# Altium schematic sheet [4]-RF.SchDoc
size A4
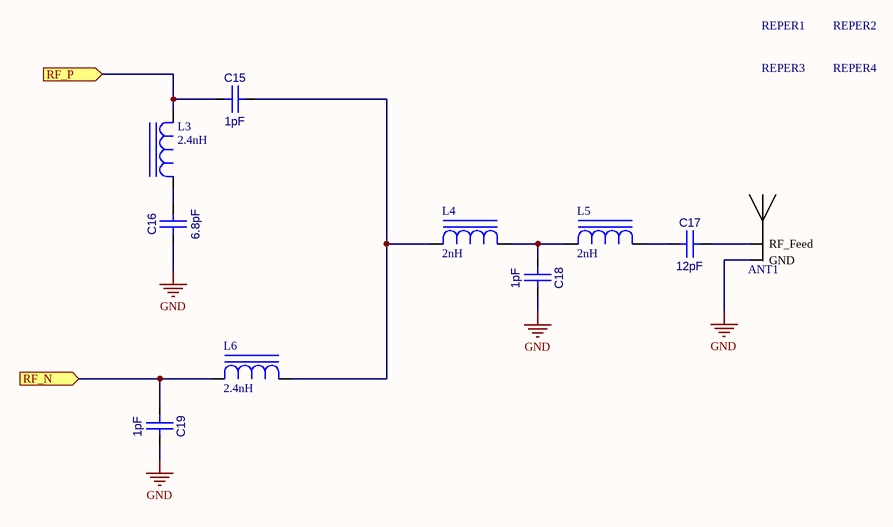
[diagram p0: [4]-RF.SchDoc]

## Parts
ANT1  IFA_TI_2.4G_Reference  [ANT_IFA_2.4G_BEST]  (value not drawn)
C15  1pF  [CC0603]
C16  6.8pF  [CC0603]
C17  12pF  [CC0603]
C18  1pF  [CC0603]
C19  1pF  [CC0603]
L3  2.4nH  [L0402]
L4  2nH  [L0402]
L5  2nH  [L0402]
L6  2.4nH  [L0402]
REPER1  REPER1.2  [REPER1.2]  (value not drawn)
REPER2  REPER1.2  [REPER1.2]  (value not drawn)
REPER3  REPER1.2  [REPER1.2]  (value not drawn)
REPER4  REPER1.2  [REPER1.2]  (value not drawn)

## Ports
RF_N (in), RF_P (in)

## Nets
GND: ANT1.2(GND) C16.1(A) C18.2(B) C19.2(B)
RF_N: C19.1(A) L6.1(A) ; port RF_N
RF_P: C15.1(A) L3.2(C) ; port RF_P
NetANT1_1: ANT1.1(RF_Feed) C17.2(B)
NetC15_2: C15.2(B) L4.1(A) L6.2(C)
NetC16_2: C16.2(B) L3.1(A)
NetC17_1: C17.1(A) L5.2(C)
NetC18_1: C18.1(A) L4.2(C) L5.1(A)

Not connected (* = marked no-connect by the designer): REPER1 1; REPER2 1; REPER3 1; REPER4 1

## Library data of the parts
ANT1 = ANT_WiFi_IFA_BEST: Value: IFA_TI_2.4G_Reference
C15-C19 = CC0603
  C15 C18 C19: Value: 1pF
  C16: Value: 6.8pF
  C17: Value: 12pF
L3-L6 = L0402
  L3 L6: Value: 2.4nH
  L4 L5: Value: 2nH
REPER1-REPER4 = REPER1.2: Value: *